# EAGLE design I2C_SlipRing v1 (EAGLE 7.2.0)
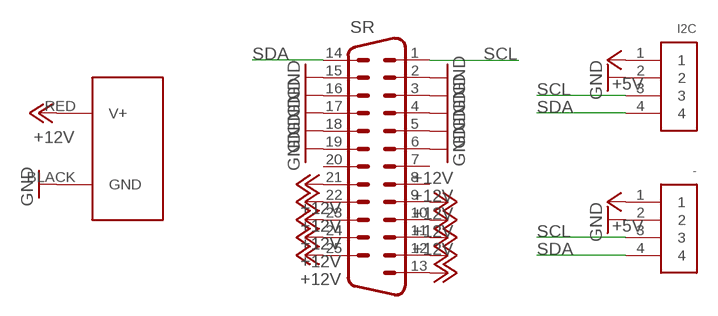
[diagram p0: schematic, sheet 1]

## Parts
-  1X4-CLEANBIG  [1X04-CLEANBIG]
I2C  1X4-CLEANBIG  [1X04-CLEANBIG]
J1  POWERPOLE_POWER25A_HORIZONTAL_G2  [POWERPOLE_PAIR_25A_HORIZ_G2]
SR  DB25HP  [M25HP]

## Nets
+5V: -.1 I2C.1
+12V: J1.RED(V+) SR.9 SR.10 SR.11 SR.12 SR.13 SR.21 SR.22 SR.23 SR.24 SR.25
GND: -.2 I2C.2 J1.BLACK(GND) SR.2 SR.3 SR.4 SR.5 SR.6 SR.15 SR.16 SR.17 SR.18 SR.19
SCL: -.3 I2C.3 SR.1
SDA: -.4 I2C.4 SR.14
Unconnected: SR.7 SR.8 SR.20

## Library data of the parts
- I2C = adafruit:1X4: 4-pin connector
J1 = powerpoles:POWERPOLE_POWER: Anderson Powerpole Power Connector using ameteur radio standard layout
SR = SparkFun-Connectors:DB25: Various DB25 connectors

## Board
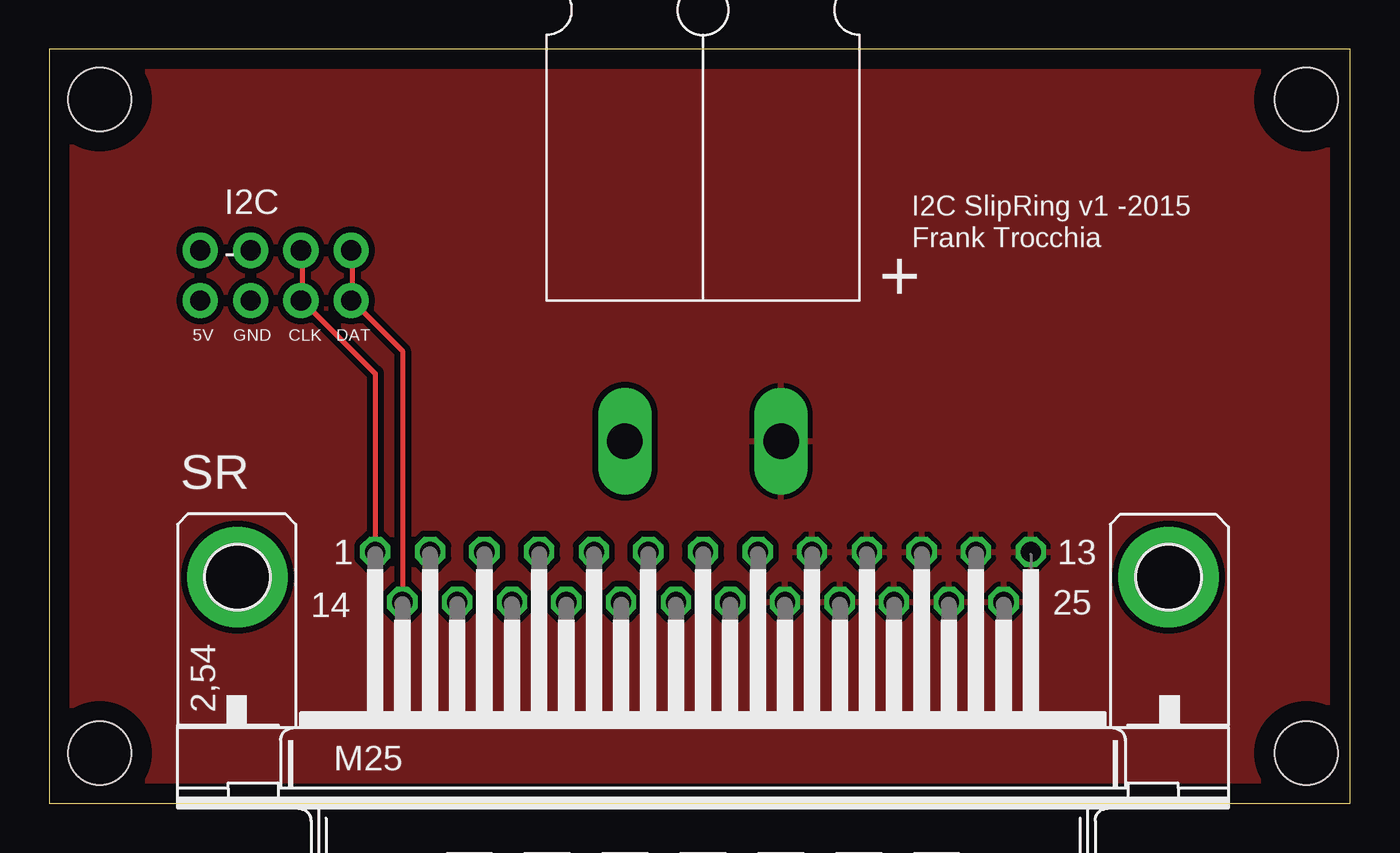
[diagram p1: board, top side]
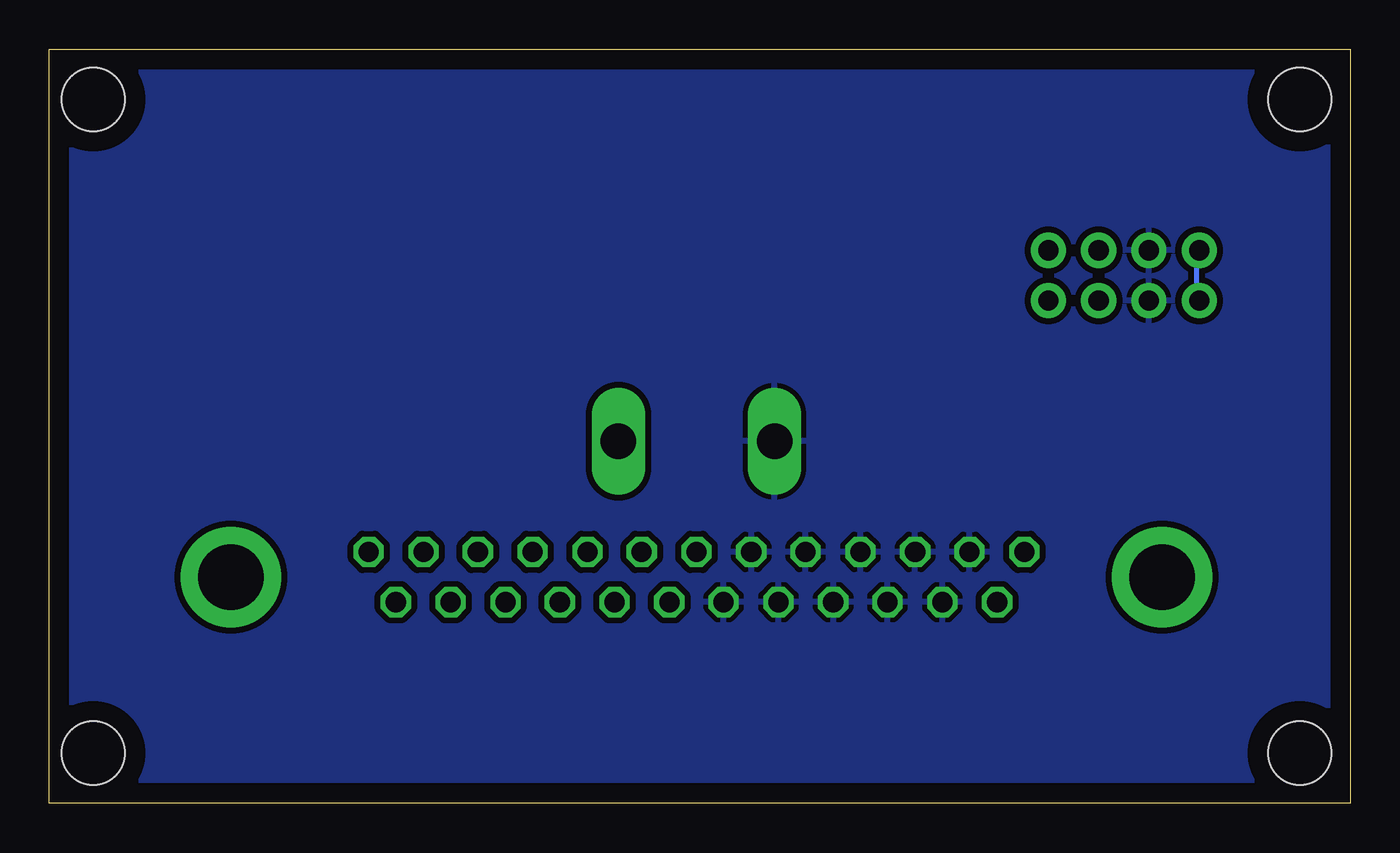
[diagram p2: board, bottom side, seen from below]

Size 65.71 x 38.09 mm. Coordinates in mm from the lower left corner, seen from the top.
Outline: 0,0 65.71,0 65.71,38.09 0,38.09 0,0
Copper layers (1*16): Top 0.035mm / dielectric 1.5mm / Bottom 0.035mm
Design rules "default": minimum track width 10mil, minimum drill 24mil, track to track 8mil, track to pad 8mil, pad to pad 8mil, via to via 8mil, smd to smd 8mil, copper to edge 40mil, drill to drill 8mil, minimum pad ring 10mil, minimum via ring 8mil, stop-mask expansion 4mil, vias tented up to drill 0mil, thermal gap 10mil
Holes 3.2 mm at 2.54,2.54 63.5,2.54 2.54,35.56 63.5,35.56

### Footprints (pad centres in the part's own frame; a part is rotated, then mirrored left to right if it is on the bottom)
1X04-CLEANBIG = drill 1.016 pad 1.778: 1 -3.81,0; 2 -1.27,0; 3 1.27,0; 4 3.81,0
POWERPOLE_PAIR_25A_HORIZ_G2 = drill 1.8 long: BLACK -3.95,-7.1; RED 3.95,-7.1
M25HP = drill 1.016 octagon: 1 -16.561,1.27; 2 -13.792,1.27; 3 -11.049,1.27; 4 -8.28,1.27; 5 -5.512,1.27; 6 -2.769,1.27; 7 0,1.27; 8 2.769,1.27; 9 5.512,1.27; 10 8.28,1.27; 11 11.049,1.27; 12 13.792,1.27; 13 16.561,1.27; 14 -15.189,-1.27; 15 -12.421,-1.27; 16 -9.652,-1.27; 17 -6.909,-1.27; 18 -4.14,-1.27; 19 -1.372,-1.27; 20 1.372,-1.27; 21 4.14,-1.27; 22 6.909,-1.27; 23 9.652,-1.27; 24 12.421,-1.27; 25 15.189,-1.27 | drill 3.302 pad 5.08: G1 -23.52,0; G2 23.52,0

### Placement (x,y rotation side)
-  11.43,25.4 0 top
I2C  11.43,27.94 0 top
J1  33.02,25.4 0 top
SR  33.02,11.43 0 top

### Tracks (layer width: path | path; a pad name or v marks a point on that pad's centre or on a via)
+5V
  Bottom 0.254: -.1 7.77,25.6 7.77,27.89 I2C.1
+12V
  pour Top (isolate 0.305): 0,38.05 65.79,38.05 65.79,0 0,0
GND
  pour Bottom (isolate 0.305): 0,38.05 65.79,38.05 65.79,0 0,0
SCL
  Top 0.254: SR.1 16.46,21.72 12.8,25.38 -.3 12.8,25.6 12.8,27.89 I2C.3
SDA
  Top 0.254: SR.14 17.83,22.86 15.32,25.38 -.4 15.32,25.6 15.32,27.89 I2C.4

### Text on the board
_tsilk: I2C SlipRing v1 -2015 | Frank Trocchia | 5V | GND | CLK | DAT